# Altium project PCB_Project1.PrjPCB
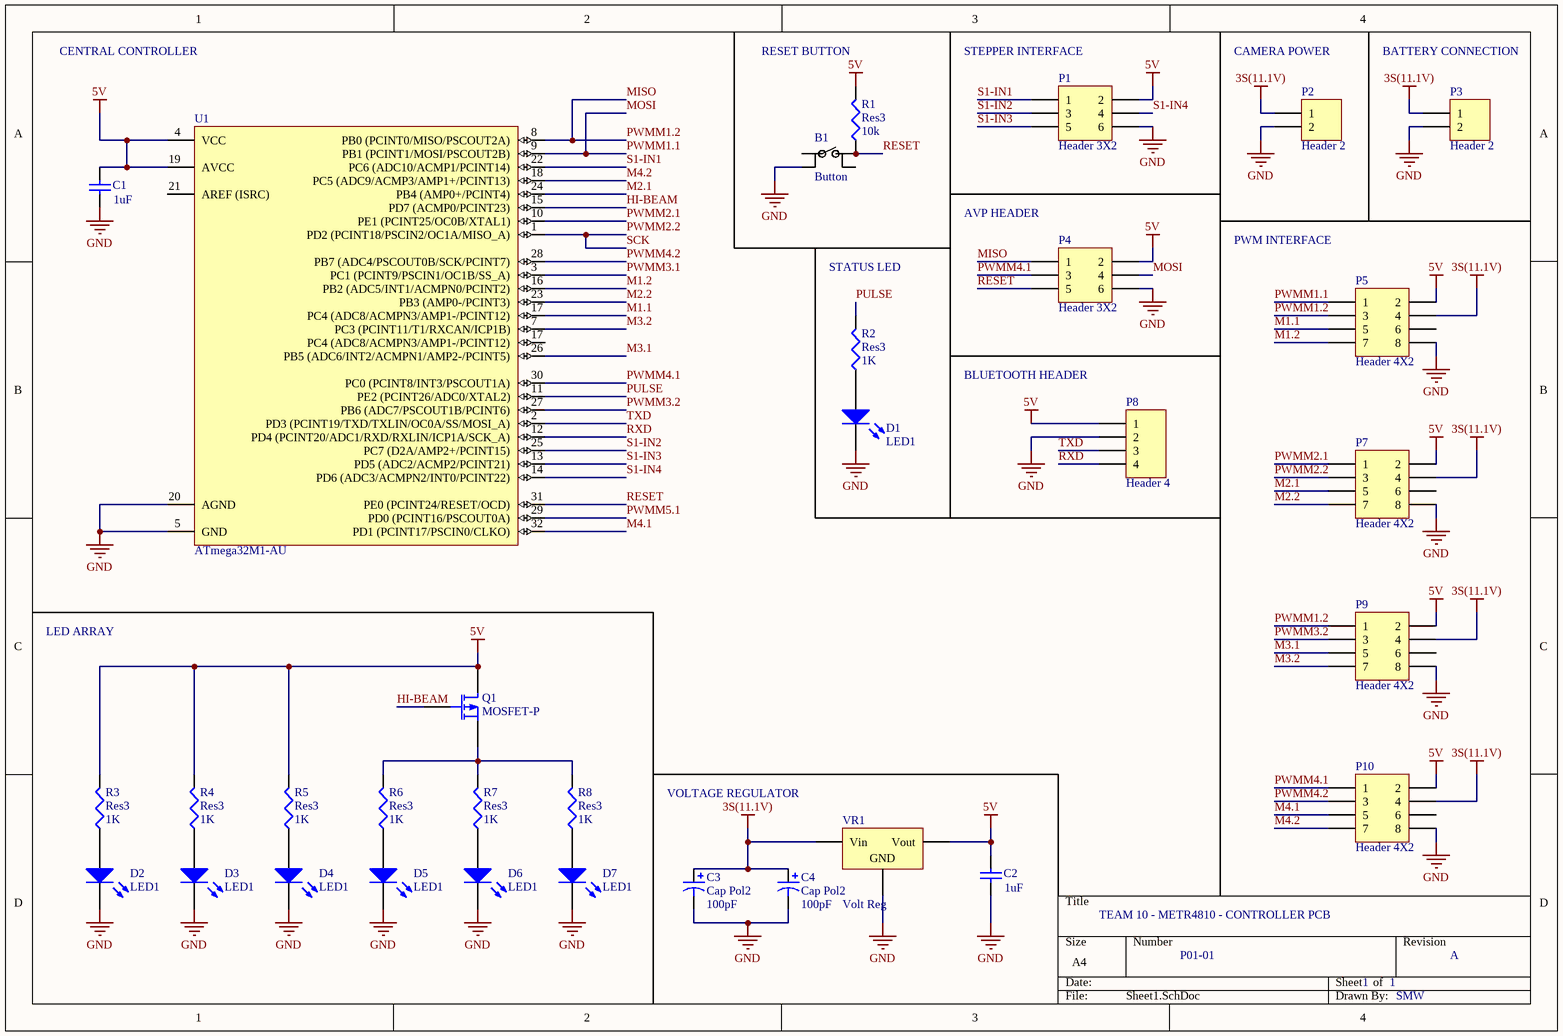
[diagram p0: Sheet1.SchDoc]
2 sheets, 49 parts. Net scope: global (net labels, ports and power ports of the same name join across sheets).
Board files: PCB1.PcbDoc, PCB2.PcbDoc
Sheets:
  Sheet1.SchDoc
  Sheet2.SchDoc

## Sheet Sheet1.SchDoc: METR4810 - Team 10 - Controller PCB
size A4; Date: 09/03/2017; Author: SMW; DrawnBy: SMW; Engineer: SMW; Revision: A; SheetNumber: 1; SheetTotal: 1

### Parts
B1  Button  [SMT Tactile Button]
C1  value 1uF  [1608[0603]]  (hidden comment: Cap)
C2  value 1uF  [1608[0603]]  (hidden comment: Cap)
C3  Cap Pol2  value 100pF  [CAPAE9983X105M]
C4  Cap Pol2  value 100pF  [CAPAE9983X105M]
D1  LED1  [L0603]
D2  LED1  [HDR1X2]
D3  LED1  [HDR1X2]
D4  LED1  [HDR1X2]
D5  LED1  [HDR1X2]
D6  LED1  [HDR1X2]
D7  LED1  [HDR1X2]
P1  Header 3X2  [HDR2X3]
P2  Header 2  [HDR1X2]
P3  Header 2  [HDR1X2]
P4  Header 3X2  [HDR2X3]
P5  Header 4X2  [HDR2X4]
P7  Header 4X2  [HDR2X4]
P8  Header 4  [HDR1X4]
P9  Header 4X2  [HDR2X4]
P10  Header 4X2  [HDR2X4]
Q1  MOSFET-P  [SOT23-3]
R1  Res3  value 10k  [J1-0603]
R2  Res3  value 1K  [J1-0603]
R3  Res3  value 1K  [J1-0603]
R4  Res3  value 1K  [J1-0603]
R5  Res3  value 1K  [J1-0603]
R6  Res3  value 1K  [J1-0603]
R7  Res3  value 1K  [J1-0603]
R8  Res3  value 1K  [J1-0603]
U1  ATmega32M1-AU  [32A_L]
VR1  Volt Reg  [D2PAK_N]

### Nets
3S(11.1V): C3.1 C4.1 P2.1 P3.1 P5.4 P7.4 P9.4 P10.4 VR1.1(Vin)
5V: C1.2 C2.2 P1.2 P4.2 P5.2 P7.2 P8.1 P9.2 P10.2 Q1.1(D) R1.2 R3.2 R4.2 R5.2 U1.4(VCC) U1.19(AVCC) VR1.3(Vout)
GND: B1.2 C1.1 C2.1 C3.2 C4.2 D1.2(K) D2.2(K) D3.2(K) D4.2(K) D5.2(K) D6.2(K) D7.2(K) P1.6 P2.2 P3.2 P4.6 P5.8 P7.8 P8.2 P9.8 P10.8 U1.5(GND) U1.20(AGND) VR1.2(GND)
HI-BEAM: Q1.2(G) U1.15(PD7_(ACMP0/PCINT23))
M1.1: P5.5 U1.17(PC4_(ADC8/ACMPN3/AMP1-/PCINT12))
M1.2: P5.7 U1.16(PB2_(ADC5/INT1/ACMPN0/PCINT2))
M2.1: P7.5 U1.24(PB4_(AMP0+/PCINT4))
M2.2: P7.7 U1.23(PB3_(AMP0-/PCINT3))
M3.1: P9.5 U1.26(PB5_(ADC6/INT2/ACMPN1/AMP2-/PCINT5))
M3.2: P9.7 U1.7(PC3_(PCINT11/T1/RXCAN/ICP1B))
M4.1: P10.5 U1.32(PD1_(PCINT17/PSCIN0/CLKO))
M4.2: P10.7 U1.18(PC5_(ADC9/ACMP3/AMP1+/PCINT13))
MISO: P4.1 P5.3 P9.1 U1.8(PB0_(PCINT0/MISO/PSCOUT2A))  [also labelled PWMM1.2]
MOSI: P4.4 P5.1 U1.9(PB1_(PCINT1/MOSI/PSCOUT2B))  [also labelled PWMM1.1]
PULSE: R2.2 U1.11(PE2_(PCINT26/ADC0/XTAL2))
PWMM2.1: P7.1 U1.10(PE1_(PCINT25/OC0B/XTAL1))
PWMM2.2: P7.3 U1.1(PD2_(PCINT18/PSCIN2/OC1A/MISO_A))  [also labelled SCK]  [project net P1]
PWMM3.1: U1.3(PC1_(PCINT9/PSCIN1/OC1B/SS_A))
PWMM3.2: P9.3 U1.27(PB6_(ADC7/PSCOUT1B/PCINT6))
PWMM4.1: P4.3 P10.1 U1.30(PC0_(PCINT8/INT3/PSCOUT1A))
PWMM4.2: P10.3 U1.28(PB7_(ADC4/PSCOUT0B/SCK/PCINT7))
PWMM5.1: U1.29(PD0_(PCINT16/PSCOUT0A))
RESET: B1.4 P4.5 R1.1 U1.31(PE0_(PCINT24/RESET/OCD))
RXD: P8.4 U1.12(PD4_(PCINT20/ADC1/RXD/RXLIN/ICP1A/SCK_A))
S1-IN1: P1.1 U1.22(PC6_(ADC10/ACMP1/PCINT14))
S1-IN2: P1.3 U1.25(PC7_(D2A/AMP2+/PCINT15))
S1-IN3: P1.5 U1.13(PD5_(ADC2/ACMP2/PCINT21))
S1-IN4: P1.4 U1.14(PD6_(ADC3/ACMPN2/INT0/PCINT22))
TXD: P8.3 U1.2(PD3_(PCINT19/TXD/TXLIN/OC0A/SS/MOSI_A))
NetD1_1: D1.1(A) R2.1
NetD2_1: D2.1(A) R3.1
NetD3_1: D3.1(A) R4.1
NetD4_1: D4.1(A) R5.1
NetD5_1: D5.1(A) R6.1
NetD6_1: D6.1(A) R7.1
NetD7_1: D7.1(A) R8.1
NetQ1_3: Q1.3(S) R6.2 R7.2 R8.2

Not connected (* = marked no-connect by the designer): B1 1 3; P5 6; P7 6; P9 6; P10 6; U1 21(AREF_(ISRC))

### Notes on the sheet
- CENTRAL CONTROLLER
- (near R1) RESET BUTTON
- (near P1) STEPPER INTERFACE
- CAMERA POWER
- BATTERY CONNECTION
- (near P4) AVP HEADER
- PWM INTERFACE
- STATUS LED
- BLUETOOTH HEADER
- LED ARRAY
- VOLTAGE REGULATOR
- TEAM 10 - METR4810 - CONTROLLER PCB
- P01-01
- 1
- A
- SMW

### Library data of the parts
B1 = Switch
C1 C2 = Cap: Capacitor; Published: 8-Jun-2000; LatestRevisionDate: 17-Jul-2002; LatestRevisionNote: Re-released for DXP Platform.; PackageReference: RAD-0.3; Publisher: Altium Limited; PackageDescription: Radial Cap, Thru-Hole; 2 Leads; 0.3 in Pin Spacing
C3 C4 = Cap Pol2: Polarized Capacitor (Axial); Published: 8-Jun-2000; LatestRevisionDate: 17-Jul-2002; LatestRevisionNote: Re-released for DXP Platform.; PackageReference: POLAR0.8; Publisher: Altium Limited; PackageDescription: Polarized Capacitor; 2 Leads
D1-D7 = LED1: Typical RED GaAs LED; Published: 8-Jun-2000; LatestRevisionDate: 08-Jul-2005; LatestRevisionNote: Mech Layer 1 removed.; PackageReference: LED-1; Publisher: Altium Limited; PackageDescription: LED; 2 Leads
P1 P4 = Header 3X2: Header, 3-Pin, Dual row; LatestRevisionDate: 17-Jul-2002; LatestRevisionNote: Re-released for DXP Platform.; Publisher: Altium Limited
P2 P3 = Header 2: Header, 2-Pin; LatestRevisionDate: 17-Jul-2002; LatestRevisionNote: Re-released for DXP Platform.; Publisher: Altium Limited
P5 P7 P9 P10 = Header 4X2: Header, 4-Pin, Dual row; LatestRevisionDate: 17-Jul-2002; LatestRevisionNote: Re-released for DXP Platform.; Publisher: Altium Limited
P8 = Header 4: Header, 4-Pin; LatestRevisionDate: 17-Jul-2002; LatestRevisionNote: Re-released for DXP Platform.; Publisher: Altium Limited
Q1 = MOSFET-P: P-Channel MOSFET; Published: 8-Jun-2000; LatestRevisionDate: 17-Jul-2002; LatestRevisionNote: Re-released for DXP Platform.; PackageVersion: 1995/1996; PackageReference: E3; Publisher: Altium Limited; PackageDescription: TO, Flat Index; 3 In-Line, Axial Leads; Body Dia. 4.6mm; Lead Dia. 0.5 mm (max)
R1-R8 = Res3: Resistor; Published: 8-Jun-2000; LatestRevisionDate: 29-May-2009; LatestRevisionNote: IPC-7351 Footprint Added.; PackageReference: J1-0603; Publisher: Altium Limited; PackageDescription: Chip Resistor
U1 = ATmega32M1-AU: 8-bit AVR Microcontroller, 2.7-5.5V, 16MHz, 32KB Flash, 1KB EEPROM, 2KB SRAM, Industrial Grade (-40° to +85°C), 32-Pin TQFP; DatasheetVersion: revD, Nov-2010; PackageVersion: revC, Oct-2010; PackageReference: 32A; PackageDescription: 32-Lead, 7x7x1.0 mm Body, 0.8mm Lead Pitch, Thin Profile Plastic Quad Flat Package (TQFP); Code_JEDEC: MS-026-ABA; ComponentLink1Description: Manufacturer URL; ComponentLink1URL: http://www.atmel.com/; ComponentLink2Description: ATmega16M1/32M1/64M1 Datasheet; ComponentLink2URL: http://www.atmel.com/dyn/resources/prod_documents/doc8209.pdf; ComponentLink3Description: ATmega16M1/32M1/64M1 Summary; ComponentLink3URL: http://www.atmel.com/dyn/resources/prod_documents/8209S.pdf
VR1 = Volt Reg: Voltage Regulator; Published: 24-Mar-1999; LatestRevisionDate: 29-May-2009; LatestRevisionNote: IPC-7351 Footprint Added.; PackageReference: D2PAK; Publisher: Altium Limited; PackageDescription: 3-Pin Transistor Outline Package 2.54 mm Pitch, 15.1 mm Lead Span

## Sheet Sheet2.SchDoc
size A4
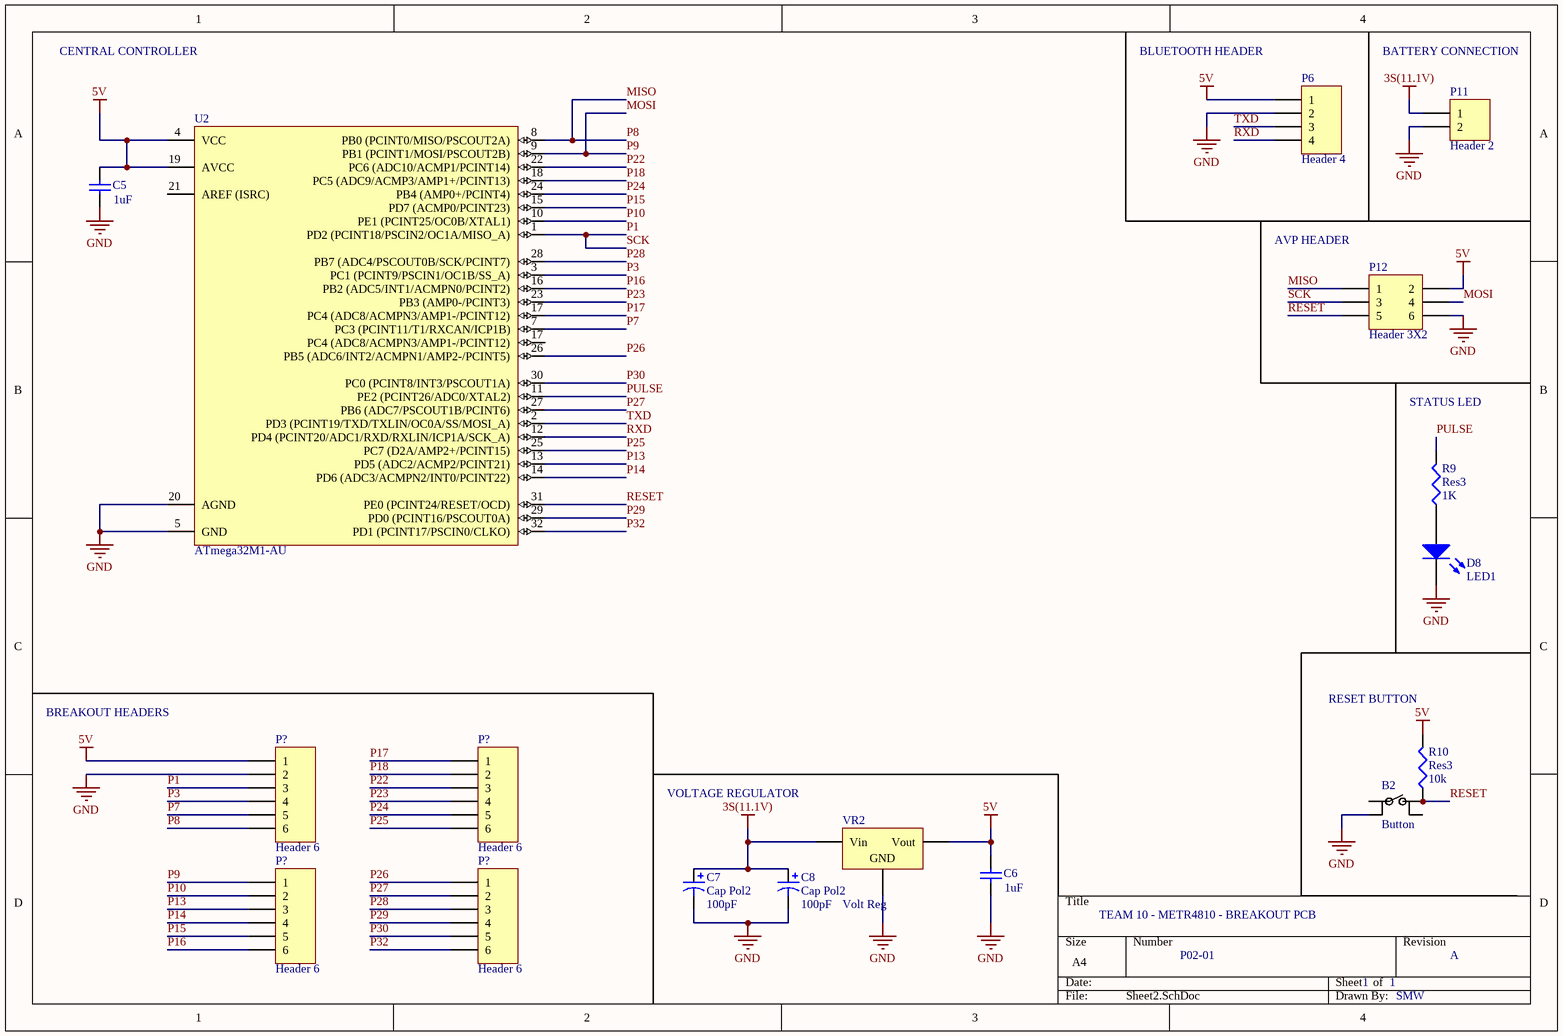
[diagram p1: Sheet2.SchDoc]

### Parts
(Parts that share a designator on the sheet are numbered #1, #2 ... from top to bottom, then left to right.)
B2  Button  [SMT Tactile Button]
C5  value 1uF  [1608[0603]]  (hidden comment: Cap)
C6  value 1uF  [1608[0603]]  (hidden comment: Cap)
C7  Cap Pol2  value 100pF  [CAPAE9983X105M]
C8  Cap Pol2  value 100pF  [CAPAE9983X105M]
D8  LED1  [L0603]
P6  Header 4  [HDR1X4]
P11  Header 2  [HDR1X2]
P12  Header 3X2  [HDR2X3]
P?#1  Header 6  [HDR1X6]
P?#2  Header 6  [HDR1X6]
P?#3  Header 6  [HDR1X6]
P?#4  Header 6  [HDR1X6]
R9  Res3  value 1K  [J1-0603]
R10  Res3  value 10k  [J1-0603]
U2  ATmega32M1-AU  [32A_L]
VR2  Volt Reg  [D2PAK_N]

### Nets
3S(11.1V): C7.1 C8.1 P11.1 VR2.1(Vin)
5V: C5.2 C6.2 P6.1 P12.2 P?#1.1 R10.2 U2.4(VCC) U2.19(AVCC) VR2.3(Vout)
GND: B2.2 C5.1 C6.1 C7.2 C8.2 D8.2(K) P6.2 P11.2 P12.6 P?#1.2 U2.5(GND) U2.20(AGND) VR2.2(GND)
MISO: P12.1 P?#1.6 U2.8(PB0_(PCINT0/MISO/PSCOUT2A))  [also labelled P8]
MOSI: P12.4 P?#3.1 U2.9(PB1_(PCINT1/MOSI/PSCOUT2B))  [also labelled P9]
P1: P12.3 P?#1.3 U2.1(PD2_(PCINT18/PSCIN2/OC1A/MISO_A))  [also labelled SCK]
P3: P?#1.4 U2.3(PC1_(PCINT9/PSCIN1/OC1B/SS_A))
P7: P?#1.5 U2.7(PC3_(PCINT11/T1/RXCAN/ICP1B))
P10: P?#3.2 U2.10(PE1_(PCINT25/OC0B/XTAL1))
P13: P?#3.3 U2.13(PD5_(ADC2/ACMP2/PCINT21))
P14: P?#3.4 U2.14(PD6_(ADC3/ACMPN2/INT0/PCINT22))
P15: P?#3.5 U2.15(PD7_(ACMP0/PCINT23))
P16: P?#3.6 U2.16(PB2_(ADC5/INT1/ACMPN0/PCINT2))
P17: P?#2.1 U2.17(PC4_(ADC8/ACMPN3/AMP1-/PCINT12))
P18: P?#2.2 U2.18(PC5_(ADC9/ACMP3/AMP1+/PCINT13))
P22: P?#2.3 U2.22(PC6_(ADC10/ACMP1/PCINT14))
P23: P?#2.4 U2.23(PB3_(AMP0-/PCINT3))
P24: P?#2.5 U2.24(PB4_(AMP0+/PCINT4))
P25: P?#2.6 U2.25(PC7_(D2A/AMP2+/PCINT15))
P26: P?#4.1 U2.26(PB5_(ADC6/INT2/ACMPN1/AMP2-/PCINT5))
P27: P?#4.2 U2.27(PB6_(ADC7/PSCOUT1B/PCINT6))
P28: P?#4.3 U2.28(PB7_(ADC4/PSCOUT0B/SCK/PCINT7))
P29: P?#4.4 U2.29(PD0_(PCINT16/PSCOUT0A))
P30: P?#4.5 U2.30(PC0_(PCINT8/INT3/PSCOUT1A))
P32: P?#4.6 U2.32(PD1_(PCINT17/PSCIN0/CLKO))
PULSE: R9.2 U2.11(PE2_(PCINT26/ADC0/XTAL2))
RESET: B2.4 P12.5 R10.1 U2.31(PE0_(PCINT24/RESET/OCD))
RXD: P6.4 U2.12(PD4_(PCINT20/ADC1/RXD/RXLIN/ICP1A/SCK_A))
TXD: P6.3 U2.2(PD3_(PCINT19/TXD/TXLIN/OC0A/SS/MOSI_A))
NetD8_1: D8.1(A) R9.1

Not connected (* = marked no-connect by the designer): B2 1 3; U2 21(AREF_(ISRC))

### Notes on the sheet
- CENTRAL CONTROLLER
- BLUETOOTH HEADER
- BATTERY CONNECTION
- (near P12) AVP HEADER
- STATUS LED
- BREAKOUT HEADERS
- (near R10) RESET BUTTON
- VOLTAGE REGULATOR
- TEAM 10 - METR4810 - BREAKOUT PCB
- P02-01
- 1
- A
- SMW

### Library data of the parts
B2 = Switch
C5 C6 = Cap: Capacitor; Published: 8-Jun-2000; LatestRevisionDate: 17-Jul-2002; LatestRevisionNote: Re-released for DXP Platform.; PackageReference: RAD-0.3; Publisher: Altium Limited; PackageDescription: Radial Cap, Thru-Hole; 2 Leads; 0.3 in Pin Spacing
C7 C8 = Cap Pol2: Polarized Capacitor (Axial); Published: 8-Jun-2000; LatestRevisionDate: 17-Jul-2002; LatestRevisionNote: Re-released for DXP Platform.; PackageReference: POLAR0.8; Publisher: Altium Limited; PackageDescription: Polarized Capacitor; 2 Leads
D8 = LED1: Typical RED GaAs LED; Published: 8-Jun-2000; LatestRevisionDate: 08-Jul-2005; LatestRevisionNote: Mech Layer 1 removed.; PackageReference: LED-1; Publisher: Altium Limited; PackageDescription: LED; 2 Leads
P6 = Header 4: Header, 4-Pin; LatestRevisionDate: 17-Jul-2002; LatestRevisionNote: Re-released for DXP Platform.; Publisher: Altium Limited
P11 = Header 2: Header, 2-Pin; LatestRevisionDate: 17-Jul-2002; LatestRevisionNote: Re-released for DXP Platform.; Publisher: Altium Limited
P12 = Header 3X2: Header, 3-Pin, Dual row; LatestRevisionDate: 17-Jul-2002; LatestRevisionNote: Re-released for DXP Platform.; Publisher: Altium Limited
P?#1-P?#4 = Header 6: Header, 6-Pin; LatestRevisionDate: 17-Jul-2002; LatestRevisionNote: Re-released for DXP Platform.; Publisher: Altium Limited
R9 R10 = Res3: Resistor; Published: 8-Jun-2000; LatestRevisionDate: 29-May-2009; LatestRevisionNote: IPC-7351 Footprint Added.; PackageReference: J1-0603; Publisher: Altium Limited; PackageDescription: Chip Resistor
U2 = ATmega32M1-AU: as U1 on sheet Sheet1; DatasheetVersion: revD, Nov-2010; PackageVersion: revC, Oct-2010; PackageReference: 32A; PackageDescription: 32-Lead, 7x7x1.0 mm Body, 0.8mm Lead Pitch, Thin Profile Plastic Quad Flat Package (TQFP); Code_JEDEC: MS-026-ABA; ComponentLink1Description: Manufacturer URL; ComponentLink1URL: http://www.atmel.com/; ComponentLink2Description: ATmega16M1/32M1/64M1 Datasheet; ComponentLink2URL: http://www.atmel.com/dyn/resources/prod_documents/doc8209.pdf; ComponentLink3Description: ATmega16M1/32M1/64M1 Summary; ComponentLink3URL: http://www.atmel.com/dyn/resources/prod_documents/8209S.pdf
VR2 = Volt Reg: Voltage Regulator; Published: 24-Mar-1999; LatestRevisionDate: 29-May-2009; LatestRevisionNote: IPC-7351 Footprint Added.; PackageReference: D2PAK; Publisher: Altium Limited; PackageDescription: 3-Pin Transistor Outline Package 2.54 mm Pitch, 15.1 mm Lead Span

## Nets that join several sheets
3S(11.1V): Sheet1 (9 pins), Sheet2 (C7.1 C8.1 P11.1 VR2.1)
5V: Sheet1 (17 pins), Sheet2 (9 pins)
GND: Sheet1 (24 pins), Sheet2 (13 pins)
MISO: Sheet1 (P4.1 P5.3 P9.1 U1.8), Sheet2 (P12.1 P?#1.6 U2.8)
MOSI: Sheet1 (P4.4 P5.1 U1.9), Sheet2 (P12.4 P?#3.1 U2.9)
P1: Sheet1 (P7.3 U1.1), Sheet2 (P12.3 P?#1.3 U2.1)
PULSE: Sheet1 (R2.2 U1.11), Sheet2 (R9.2 U2.11)
RESET: Sheet1 (B1.4 P4.5 R1.1 U1.31), Sheet2 (B2.4 P12.5 R10.1 U2.31)
RXD: Sheet1 (P8.4 U1.12), Sheet2 (P6.4 U2.12)
TXD: Sheet1 (P8.3 U1.2), Sheet2 (P6.3 U2.2)